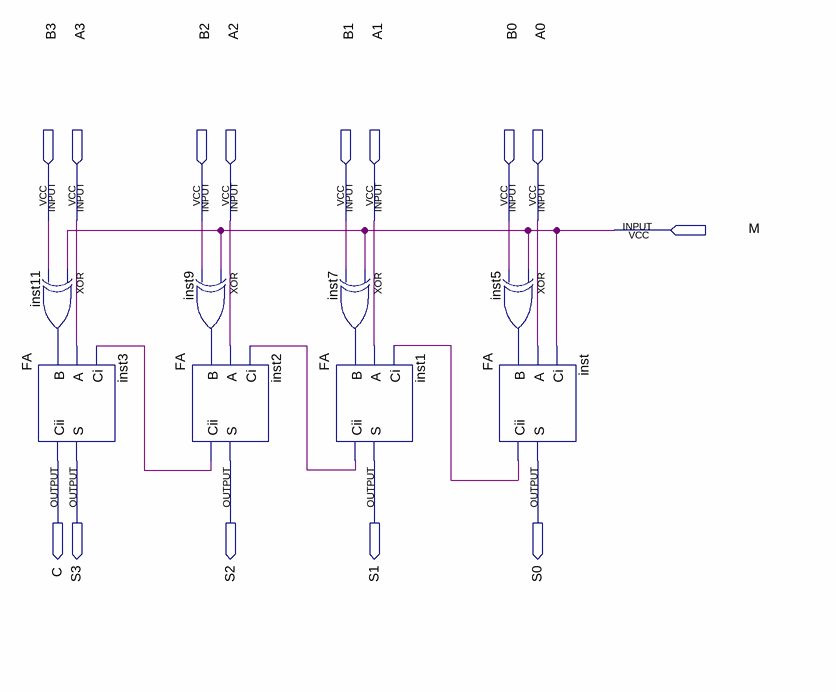
[diagram p0: schematic sheet]
// Quartus schematic 4bit.bdf as structural Verilog: 8 symbols, 14 pins
module \4bit  (
  input  B3,
  input  A3,
  input  B2,
  input  A2,
  input  B1,
  input  A1,
  input  B0,
  input  A0,
  input  M,
  output C,
  output S3,
  output S2,
  output S1,
  output S0
);

  wire inst1_cii, inst2_cii, inst5_out, inst7_out, inst9_out, inst11_out, inst_cii;

  xor inst11 (inst11_out, M, B3);
  FA inst3 (.B(inst11_out), .A(A3), .Ci(inst2_cii), .Cii(C), .S(S3));
  xor inst9 (inst9_out, M, B2);
  FA inst2 (.B(inst9_out), .A(A2), .Ci(inst1_cii), .Cii(inst2_cii), .S(S2));
  xor inst7 (inst7_out, M, B1);
  FA inst1 (.B(inst7_out), .A(A1), .Ci(inst_cii), .Cii(inst1_cii), .S(S1));
  xor inst5 (inst5_out, M, B0);
  FA inst (.B(inst5_out), .A(A0), .Ci(M), .Cii(inst_cii), .S(S0));
endmodule
